# EAGLE design LEDDimmerDuo (EAGLE 6.4)
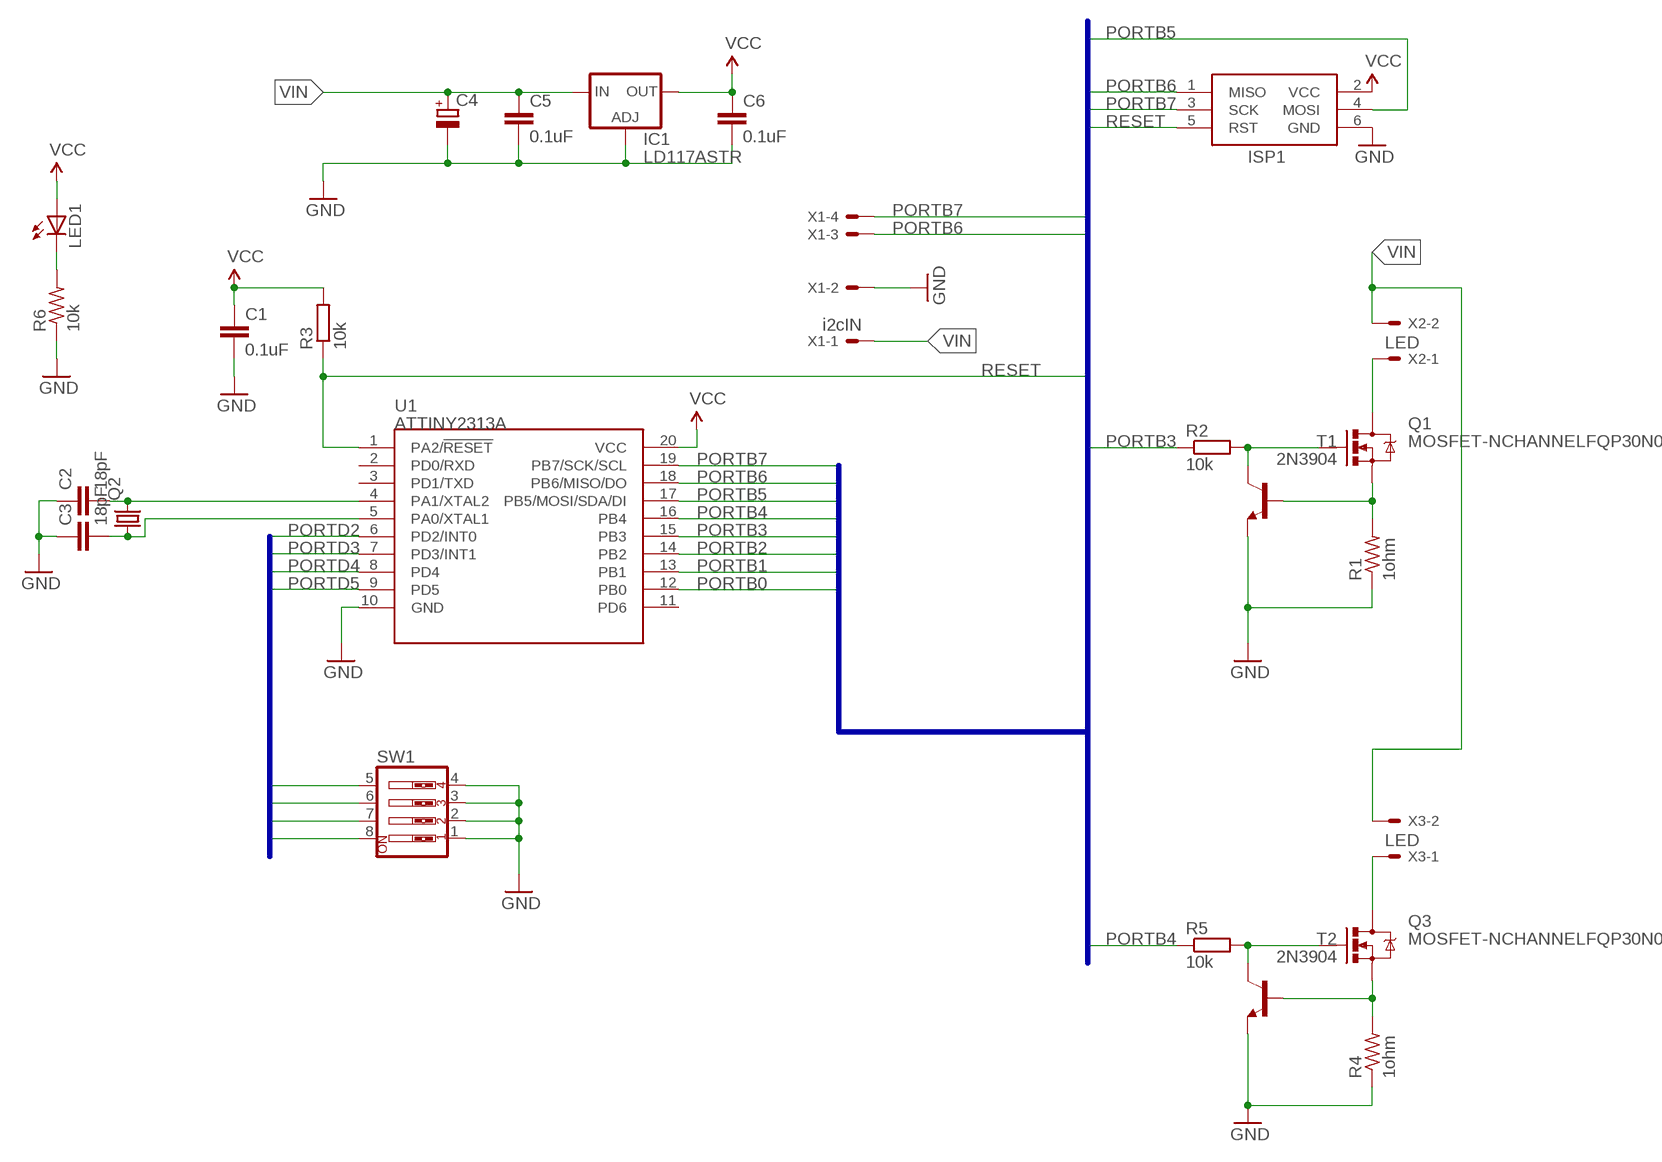
[diagram p0: schematic, sheet 1]

## Parts
C1  0.1uF  CAP0805  [0805]
C2  18pF  CAP0805  [0805]
C3  18pF  CAP0805  [0805]
C4  CPOL-EUE3.5-10  [E3,5-10]
C5  0.1uF  CAP0805  [0805]
C6  0.1uF  CAP0805  [0805]
IC1  LD117ASTR  [SOT223]
ISP1  AVRISP-6  [AVRISP]
LED1  LED0603  [LED-0603]
Q1  MOSFET-NCHANNELFQP30N06L  [TO220V]
Q2  CRYSTALSM49  [SM49]
Q3  MOSFET-NCHANNELFQP30N06L  [TO220V]
R1  1ohm  R-US_VTA54  [VTA54]
R2  10k  R-EU_R0805  [R0805]
R3  10k  R-EU_R0805  [R0805]
R4  1ohm  R-US_VTA54  [VTA54]
R5  10k  R-EU_R0805  [R0805]
R6  10k  R-US_R0603  [R0603]
SW1  SW_DIP-4  [EDG-04]
T1  2N3904  [TO92]
T2  2N3904  [TO92]
U1  ATTINY2313A  [SOP20W]
X1  i2cIN  22-23-2041  [22-23-2041]
X2  LED  22-23-2021  [22-23-2021]
X3  LED  22-23-2021  [22-23-2021]

## Nets
GND: C1.2 C2.1 C3.1 C4.- C5.2 C6.2 IC1.1(ADJ) ISP1.6(GND) R1.1 R4.1 R6.1 SW1.1 SW1.2 SW1.3 SW1.4 T1.3(E) T2.3(E) U1.10(GND) X1.2
N$1: Q1.1(G) R2.2 T1.1(C)
N$2: C3.2 Q2.1 U1.5(PA0/XTAL1)
N$3: C2.2 Q2.2 U1.4(PA1/XTAL2)
N$5: Q1.3(S) R1.2 T1.2(B)
N$6: Q1.2(D) X2.1
N$7: Q3.1(G) R5.2 T2.1(C)
N$8: Q3.3(S) R4.2 T2.2(B)
N$9: Q3.2(D) X3.1
N$10: LED1.C R6.2
PORTB0: U1.12(PB0)
PORTB1: U1.13(PB1)
PORTB2: U1.14(PB2)
PORTB3: R2.1 U1.15(PB3)
PORTB4: R5.1 U1.16(PB4)
PORTB5: ISP1.4(MOSI) U1.17(PB5/MOSI/SDA/DI)
PORTB6: ISP1.1(MISO) U1.18(PB6/MISO/DO) X1.3
PORTB7: ISP1.3(SCK) U1.19(PB7/SCK/SCL) X1.4
PORTD2: SW1.5 U1.6(PD2/INT0)
PORTD3: SW1.6 U1.7(PD3/INT1)
PORTD4: SW1.7 U1.8(PD4)
PORTD5: SW1.8 U1.9(PD5)
RESET: ISP1.5(RST) R3.1 U1.1(PA2/!RESET)
VCC: C1.1 C6.1 IC1.4(OUT) ISP1.2(VCC) LED1.A R3.2 U1.20(VCC)
VIN: C4.+ C5.1 IC1.3(IN) X1.1 X2.2 X3.2
Unconnected: U1.2(PD0/RXD) U1.3(PD1/TXD) U1.11(PD6)

## Buses
PORTB[0..7],RESET
PORTD[2..5]

## Library data of the parts
C1-C3 C5 C6 = SparkFun-Capacitors:CAP: Capacitor Standard 0603 ceramic capacitor, and 0.1" leaded capacitor.
C4 = rcl:CPOL-EU: POLARIZED CAPACITOR, European symbol
IC1 = v-reg:LD117A?*: Low drop fixed and adjustable positive voltage regulators 1 A Source: http://www.st.com/stonline/products/literature/ds/7194/ld1117axx.pdf
ISP1 = adafruit:AVRISP: AVR ISP HEADER Standard 6 pin header for AVR programming
LED1 = SparkFun-LED:LED: LEDs Standard schematic elements and footprints for 5mm, 3mm, 1206, and 0603 sized LEDs. 5mm - Spark Fun Electronics SKU : COM-00529 (and others)
Q1 Q3 = SparkFun-DiscreteSemi:MOSFET-NCHANNEL: Common NMOSFET Parts MFG P/N Store ID Prod ID FDD8780 TRANS-09984 SI7820DN TRANS-11055 FDS6630A IC-08089 2N7002PW TRANS-11151 FQP30N06L COM-10213 TRANS-10060 BSS123LT1G TRANS-08345 BSS138 TRANS-00830 BS170 2N7000; PROD_ID: TRANS-10060
Q2 = adafruit:CRYSTAL: CRYSTAL; OC_FARNELL: unknown; OC_NEWARK: unknown
R1 R4 = rcl:R-US_: RESISTOR, American symbol
R2 R3 R5 = rcl:R-EU_: RESISTOR, European symbol
R6 = adafruit:R-US_: RESISTOR, American symbol
SW1 = special:SW_DIP-4: DIP SWITCH
T1 T2 = transistor:2N3904: NPN TRANSISTOR
U1 = SparkFun-DigitalIC:ATTINY2313A: ATTINY2313A 2kB 20MHz I2C/SPI/UART; PROD_ID: IC-11305
X1 = con-molex:22-23-2041: .100" (2.54mm) Center Header - 4 Pin; MF: MOLEX; MPN: 22-23-2041; OC_FARNELL: 1462920; OC_NEWARK: 38C0355
X2 X3 = con-molex:22-23-2021: .100" (2.54mm) Center Header - 2 Pin; MF: MOLEX; MPN: 22-23-2021; OC_FARNELL: 1462926; OC_NEWARK: 25C3832

## Net classes
0 default: width 0.762 mm, clearance 0.762 mm

## Board
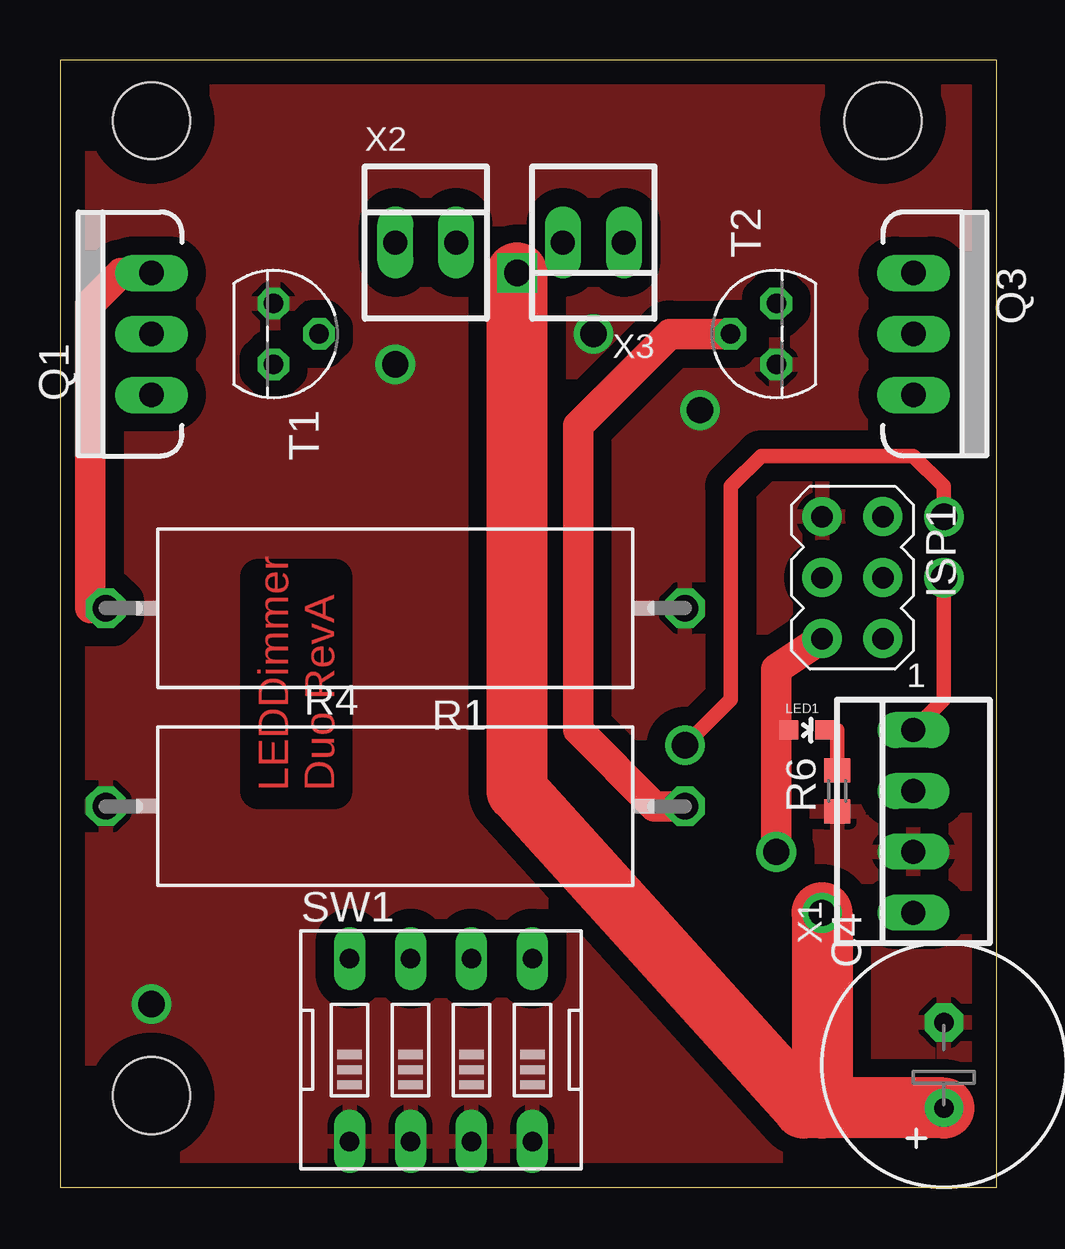
[diagram p1: board, top side]
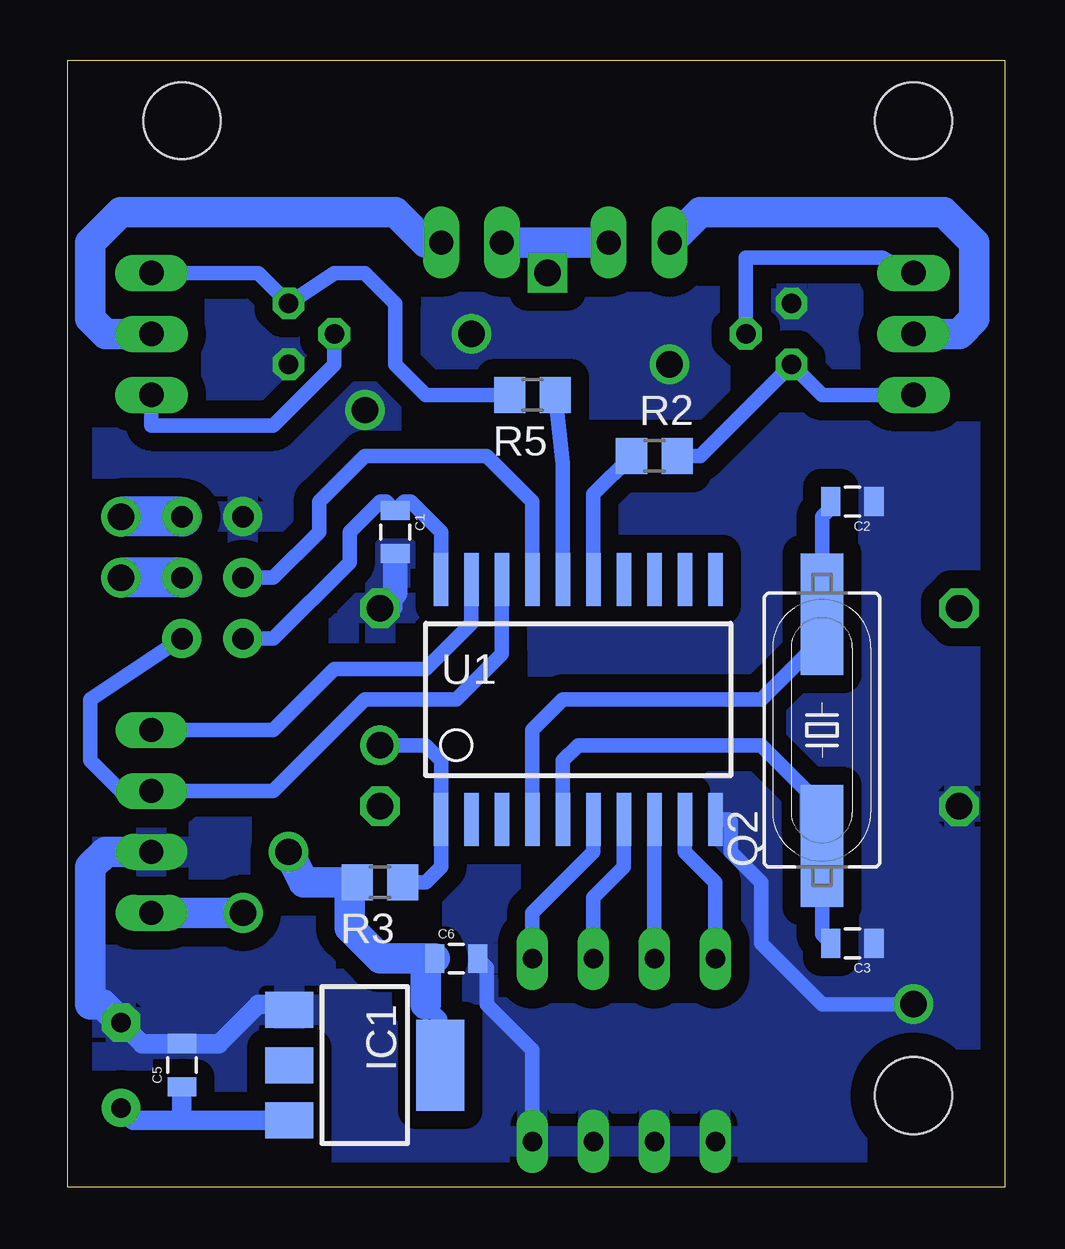
[diagram p2: board, bottom side, seen from below]

Size 39.04 x 46.98 mm. Coordinates in mm from the lower left corner, seen from the top.
Outline: 0,0 39.04,0 39.04,46.98 0,46.98 0,0
Copper layers (1*16): Top 0.035mm / dielectric 1.5mm / Bottom 0.035mm
Design rules "default": minimum track width 10mil, minimum drill 24mil, track to track 8mil, track to pad 8mil, pad to pad 8mil, via to via 8mil, smd to smd 8mil, copper to edge 40mil, drill to drill 8mil, minimum pad ring 10mil, minimum via ring 8mil, stop-mask expansion 4mil, vias tented up to drill 0mil, thermal gap 10mil
Holes 3.2 mm at 3.81,3.81 3.81,44.45 34.29,44.45

### Footprints (pad centres in the part's own frame; a part is rotated, then mirrored left to right if it is on the bottom)
0805 = smd 0.8 x 1.2: 1 -0.9,0; 2 0.9,0
E3,5-10 = drill 0.813 pad 1.6: + -1.778,0 | drill 0.813 pad 1.6 octagon: - 1.778,0
SOT223 = smd 1.5 x 2: 1 -2.3,-3.15; 2 0,-3.15; 3 2.3,-3.15 | smd 3.8 x 2: 4 0,3.15
AVRISP = drill 0.9 pad 1.626: 1 -1.27,2.54; 2 1.27,2.54; 3 -1.27,0; 4 1.27,0; 5 -1.27,-2.54; 6 1.27,-2.54
LED-0603 = smd 0.8 x 0.8: A 0,-0.75; C 0,0.75
TO220V = drill 1.016 long: 1 -2.54,0; 2 0,0; 3 2.54,0
SM49 = smd 5.08 x 1.778: 1 -4.826,0; 2 4.826,0
VTA54 = drill 1.1 octagon: 1 -12.065,0; 2 12.065,0
R0805 = smd 1.3 x 1.5: 1 -0.95,0; 2 0.95,0
R0603 = smd 1 x 1.1: 1 -0.85,0; 2 0.85,0
EDG-04 = drill 0.813 long: 1 -3.81,-3.81; 2 -1.27,-3.81; 3 1.27,-3.81; 4 3.81,-3.81; 5 3.81,3.81; 6 1.27,3.81; 7 -1.27,3.81; 8 -3.81,3.81
TO92 = drill 0.813 octagon: 1 1.27,0; 2 0,1.905; 3 -1.27,0
SOP20W = smd 0.6 x 2.2: 1 -5.715,-5; 2 -4.445,-5; 3 -3.175,-5; 4 -1.905,-5; 5 -0.635,-5; 6 0.635,-5; 7 1.905,-5; 8 3.175,-5; 9 4.445,-5; 10 5.715,-5; 11 5.715,5; 12 4.445,5; 13 3.175,5; 14 1.905,5; 15 0.635,5; 16 -0.635,5; 17 -1.905,5; 18 -3.175,5; 19 -4.445,5; 20 -5.715,5
22-23-2041 = drill 1 long: 1 -3.81,0; 2 -1.27,0; 3 1.27,0; 4 3.81,0
22-23-2021 = drill 1 long: 1 -1.27,0; 2 1.27,0

### Placement (x,y rotation side)
C1  25.4,27.3 270 bottom
C2  6.35,28.57 180 bottom
C3  6.35,10.16 180 bottom
C4  36.83,5.08 90 top
C5  34.29,5.08 90 bottom
C6  22.86,9.52 0 bottom
IC1  26.67,5.08 270 bottom
ISP1  33.02,25.4 180 top
LED1  31.11,19.05 270 top
Q1  3.81,35.56 90 top
Q2  7.62,19.05 90 bottom
Q3  35.56,35.56 270 top
R1  13.97,24.13 180 top
R2  14.61,30.48 0 bottom
R3  26.04,12.7 180 bottom
R4  13.97,15.87 0 top
R5  19.68,33.02 180 bottom
R6  32.38,16.51 90 top
SW1  15.88,5.71 0 top
T1  8.89,35.56 270 top
T2  29.84,35.56 90 top
U1  17.78,20.32 0 bottom
X1  35.56,15.24 90 top
X2  15.24,39.37 0 top
X3  22.23,39.37 180 top

### Tracks (layer width: path | path; a pad name or v marks a point on that pad's centre or on a via)
GND  (via drill 1.1)
  Bottom 0.61: U1.10 11.51,15.32 11.43,15.24 11.43,13.97 10.16,12.7 10.16,10.16 7.62,7.62 v3.81,7.62 | SW1.4 19.68,5.71 21.59,7.62 21.59,9.15 C6.2 | C1.2 25.66,26.4 25.4,26.04 | R1.1 25.4,24.76 25.4,24.13
  Bottom 0.813: IC1.1 30.06,7.62 31.11,7.62 32.76,5.98 C5.2 35.95,5.98 C4.-
  Bottom 1.016: 25.4,26.04 25.4,24.76
  Bottom 1.27: X1.2 37.47,13.97 38.1,13.33 38.1,7.62 37.59,7.62 C4.-
  other vias: 13.97,34.29 22.23,35.56 26.67,32.39
  pour Top: 0,46.99 39.37,46.99 39.37,0 0,0
  pour Bottom: 0,41.91 38.1,41.91 38.1,0 0,0
N$1
  Bottom 0.61: R2.2 12.7,30.48 T1.1 7.62,33.02 Q1.1
N$2
  Bottom 0.61: U1.5 18.41,17.78 17.78,18.41 10.16,18.41 8.26,16.51 8.26,14.86 Q2.1 7.62,10.53 C3.2
N$3
  Bottom 0.61: U1.4 19.68,19.05 18.41,20.32 10.16,20.32 7.62,22.86 Q2.2 7.62,27.94 7.25,28.31 C2.2
N$5
  Top 1.27: Q1.3 2.54,38.1 1.27,36.83 1.27,24.13 R1.2
  Bottom 0.61: T1.2 10.79,38.73 5.08,38.73 Q1.3
N$6
  Bottom 1.27: X2.1 12.7,40.64 2.54,40.64 1.27,39.37 1.27,36.19 1.91,35.56 Q1.2
N$7
  Bottom 0.61: Q3.1 31.11,38.1 T2.1 27.94,38.1 26.67,38.1 25.4,36.83 25.4,34.29 24.13,33.02 R5.2
N$8
  Top 1.27: R4.2 24.77,15.87 21.59,19.05 21.59,31.75 25.4,35.56 T2.2
  Bottom 0.61: Q3.3 35.56,31.75 30.48,31.75 27.94,34.29 T2.2
N$9
  Bottom 1.27: X3.1 24.13,39.37 25.4,40.64 36.83,40.64 38.1,39.37 38.1,36.19 37.47,35.56 Q3.2
N$10
  Top 0.61: LED1.C 32.38,19.05 R6.2
PORTB3
  Bottom 0.61: U1.15 17.14,28.89 R2.1
PORTB4
  Bottom 0.61: U1.16 18.41,30.16 R5.1
PORTB5
  Bottom 0.61: ISP1.4 30.48,25.4 28.57,27.3 28.57,28.57 26.67,30.48 21.59,30.48 19.68,28.57 U1.17
PORTB6
  Bottom 0.61: U1.18 20.95,22.22 22.86,20.32 26.67,20.32 30.48,16.51 X1.3 36.83,16.51 38.1,17.78 38.1,20.32 ISP1.1
PORTB7  (via drill 1.1)
  Top 0.61: v36.83,25.4 36.83,20.32 X1.4
  Bottom 0.61: U1.19 22.23,23.5 24.13,21.59 27.94,21.59 30.48,19.05 X1.4
  Bottom 1.676: ISP1.3 v36.83,25.4
PORTD2
  Bottom 0.61: U1.6 17.14,13.97 19.68,11.43 SW1.5
PORTD3
  Bottom 0.61: SW1.6 17.14,12.06 15.88,13.33 U1.7
PORTD4
  Bottom 0.61: SW1.7 U1.8
PORTD5
  Bottom 0.61: U1.9 13.34,13.97 12.06,12.7 SW1.8
RESET  (via drill 1.1)
  Top 0.61: v26.04,18.41 27.94,20.32 27.94,29.21 29.21,30.48 35.56,30.48 36.83,29.21 v36.83,27.94
  Bottom 0.61: R3.1 24.13,12.7 23.5,13.33 U1.1 23.5,17.78 24.13,18.41 v26.04,18.41
  Bottom 1.676: ISP1.5 v36.83,27.94
VCC  (via drill 1.1)
  Top 0.61: 29.84,19.05 LED1.A
  Top 1.27: v29.84,13.97 29.84,19.05 29.84,21.59 ISP1.2
  Bottom 0.61: IC1.4 23.52,7.01 24.13,7.62 | 24.13,9.15 C6.1 | U1.20 23.5,27.3 24.77,28.57 25.03,28.57 C1.1 25.77,28.57 26.04,28.57 27.3,27.3 27.3,26.04 30.48,22.86 ISP1.2
  Bottom 1.27: 24.13,7.62 24.13,9.15 | C6.1 26.04,9.52 27.3,10.79 27.3,12.38 R3.2 29.21,12.7 v29.84,13.97
VIN  (via drill 1.1)
  Top 2.54: C4.+ 31.75,3.3 | 31.75,3.3 30.99,3.3 19.05,16.51 v19.05,38.1 | v31.75,11.43 31.75,3.3
  Bottom 0.813: IC1.3 34.29,2.78 | 34.29,2.78 36.31,2.78 C4.+ | C5.1 34.29,2.78
  Bottom 1.27: X1.1 v31.75,11.43 | v19.05,38.1 19.05,39.37 | 19.05,39.37 X2.2 | X3.2 19.05,39.37

### Text on the board
Top: LEDDimmer / Duo RevA